# Altium schematic sheet LCD_Schem.SchDoc
size A
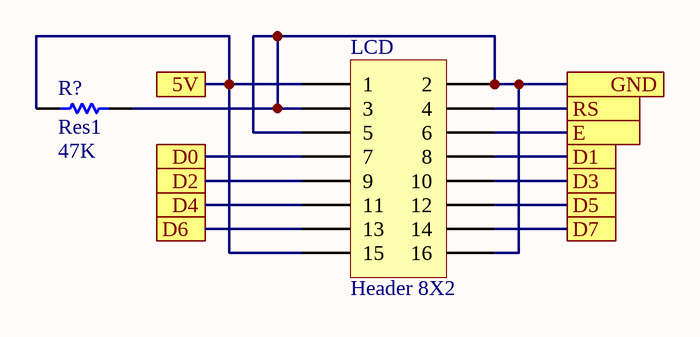
[diagram p0: LCD_Schem.SchDoc]

## Parts
LCD  Header 8X2  [HDR2X8]
R?  Res1  value 47K  [AXIAL-0.3]

## Ports
5V, D0, D1, D2, D3, D4, D5, D6, D7, E, GND, RS

## Nets
5V: LCD.1 LCD.15 R?.1 ; port 5V
D0: LCD.7 ; port D0
D1: LCD.8 ; port D1
D2: LCD.9 ; port D2
D3: LCD.10 ; port D3
D4: LCD.11 ; port D4
D5: LCD.12 ; port D5
D6: LCD.13 ; port D6
D7: LCD.14 ; port D7
E: LCD.6 ; port E
GND: LCD.2 LCD.3 LCD.5 LCD.16 R?.2 ; port GND
RS: LCD.4 ; port RS

## Library data of the parts
LCD = Header 8X2: Header, 8-Pin, Dual row; LatestRevisionDate: 17-Jul-2002; LatestRevisionNote: Re-released for DXP Platform.; Publisher: Altium Limited
R? = Res1: Resistor; Published: 8-Jun-2000; LatestRevisionDate: 17-Jul-2002; LatestRevisionNote: Re-released for DXP Platform.; PackageReference: AXIAL-0.3; Publisher: Altium Limited; PackageDescription: Axial Device, Thru-Hole; 2 Leads; 0.3 in Pin Spacing